# Altium schematic sheet TELM0002ADC.SchDoc: MAX127 Telemetry Circuit
size A3; Engineer: A. SHAW; Organization: BLUEsat Project; Address1: Room 419; Address2: School of EE&T; Address3: UNSW, NSW 2052; Address4: Australia; DocumentNumber: TELM0002; SheetNumber: 1; SheetTotal: 1; Description: Telemetry ADC Circuit; Version: 1.0
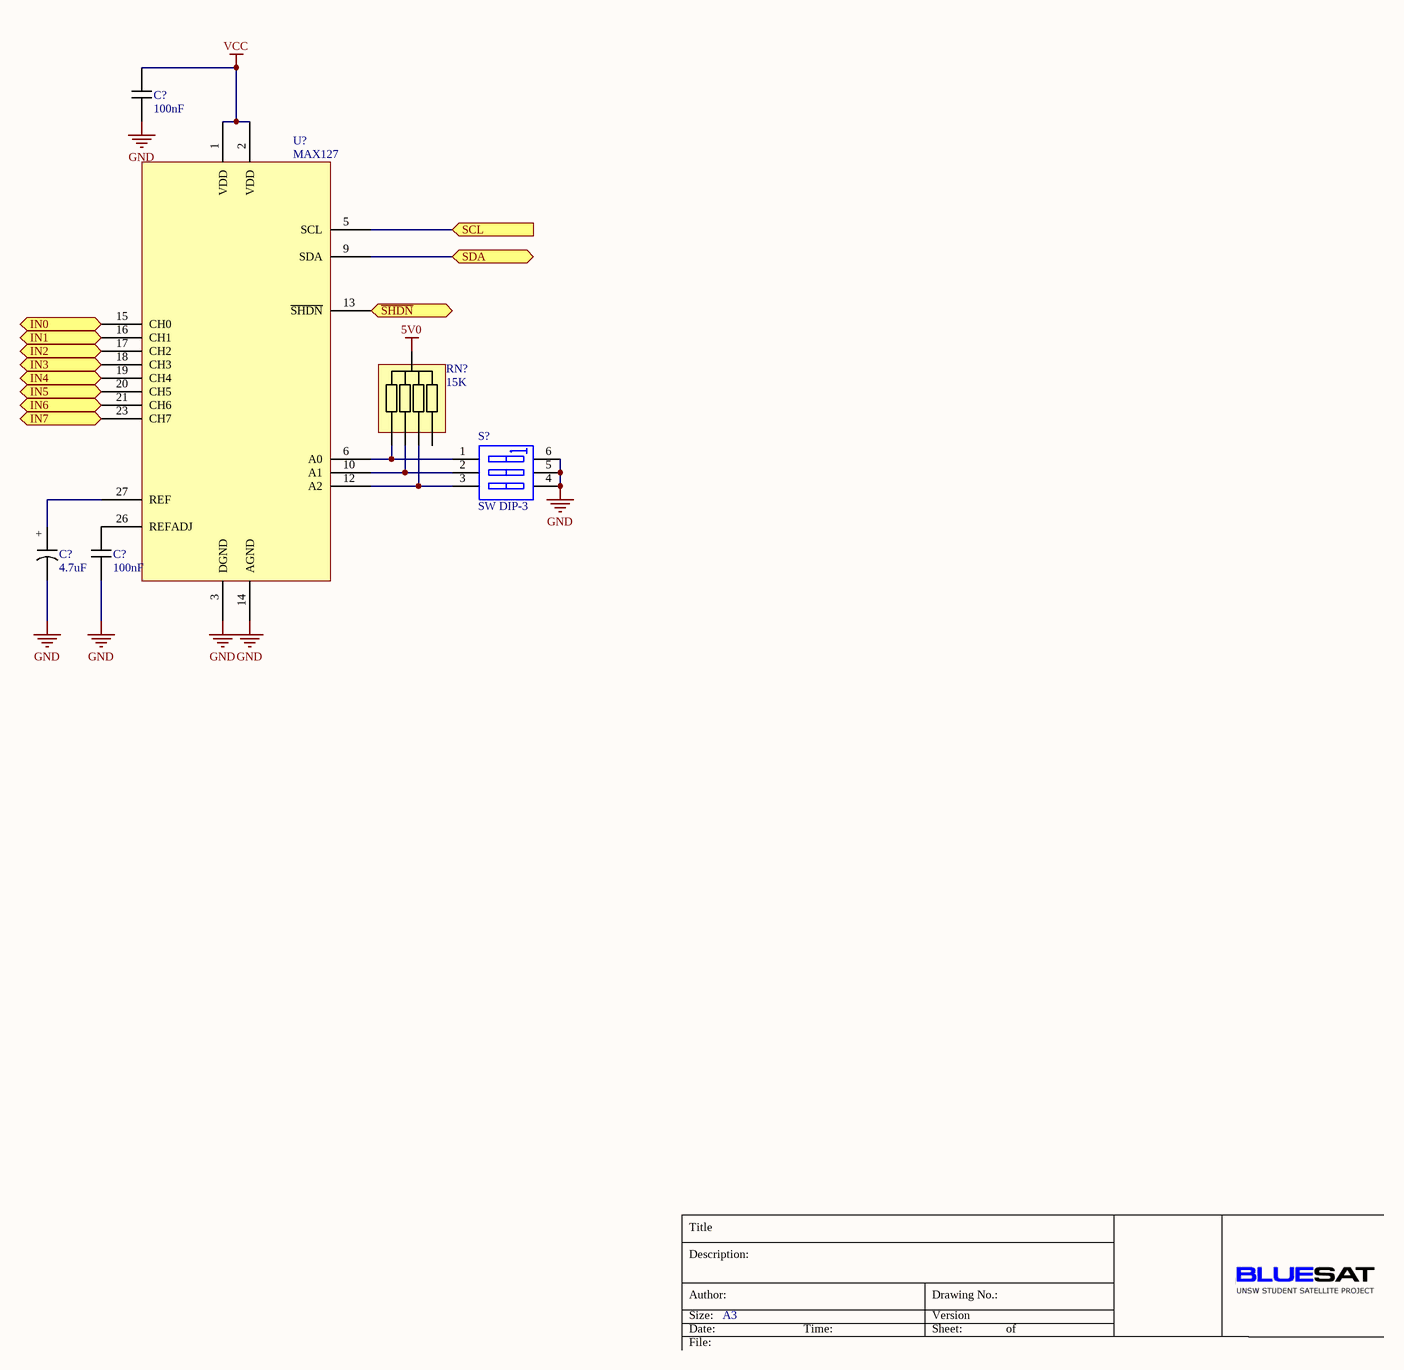
[diagram p0: TELM0002ADC.SchDoc]

## Parts
(Parts that share a designator on the sheet are numbered #1, #2 ... from top to bottom, then left to right.)
C?#1  value 100nF  [0603 Cap]  (hidden comment: 0603 Cap)
C?#2  value 4.7uF  [0603 Cap]  (hidden comment: Cap)
C?#3  value 100nF  [0603 Cap]  (hidden comment: 0603 Cap)
RN?  value 15K  (hidden comment: RN4)
S?  SW DIP-3  [DIP-6]
U?  MAX127

## Ports
IN0 (in), IN1 (in), IN2 (in), IN3 (in), IN4 (in), IN5 (in), IN6 (in), IN7 (in), SCL (in), SDA (bidir), ~{SHDN} (in)

## Nets
5V0: RN?.1
GND: C?#1.1 C?#2.- C?#3.1 S?.4(B3) S?.5(B2) S?.6(B1) U?.3(DGND) U?.14(AGND)
VCC: C?#1.2 U?.1(VDD) U?.2(VDD)
IN0: U?.15(CH0) ; port IN0
IN1: U?.16(CH1) ; port IN1
IN2: U?.17(CH2) ; port IN2
IN3: U?.18(CH3) ; port IN3
IN4: U?.19(CH4) ; port IN4
IN5: U?.20(CH5) ; port IN5
IN6: U?.21(CH6) ; port IN6
IN7: U?.23(CH7) ; port IN7
~{SHDN}: U?.13(~{SHDN}) ; port ~{SHDN}
SCL: U?.5(SCL) ; port SCL
SDA: U?.9(SDA) ; port SDA
NetC?#2_+: C?#2.+ U?.27(REF)
NetC?#3_2: C?#3.2 U?.26(REFADJ)
NetRN?_1: RN?.1 S?.1(A1) U?.6(A0)
NetRN?_1: RN?.1 S?.2(A2) U?.10(A1)  [a separate net that carries the same name]
NetRN?_1: RN?.1 S?.3(A3) U?.12(A2)  [a separate net that carries the same name]

## Notes on the sheet
- Title
- Description:
- Size:
- Author:
- Date:
- A3
- Time:
- Version
- Sheet:
- Drawing No.:
- of
- File:

## Library data of the parts
C?#1 C?#3 = 0603 MLCC - X7R, 10%
C?#2 = Polerised Capacitor
S? = SW DIP-3: DIP Switch, 3 Position, SPST; Published: 24-Mar-1999; LatestRevisionDate: 17-Jul-2002; LatestRevisionNote: Re-released for DXP Platform.; PackageReference: DIP-6; Publisher: Altium Limited; Code_JEDEC: MO-001-AM
U? = MAX127: 8 Channel, 12 bit, I2C DAS